# EAGLE design XO-Stick2 (EAGLE 6.2)
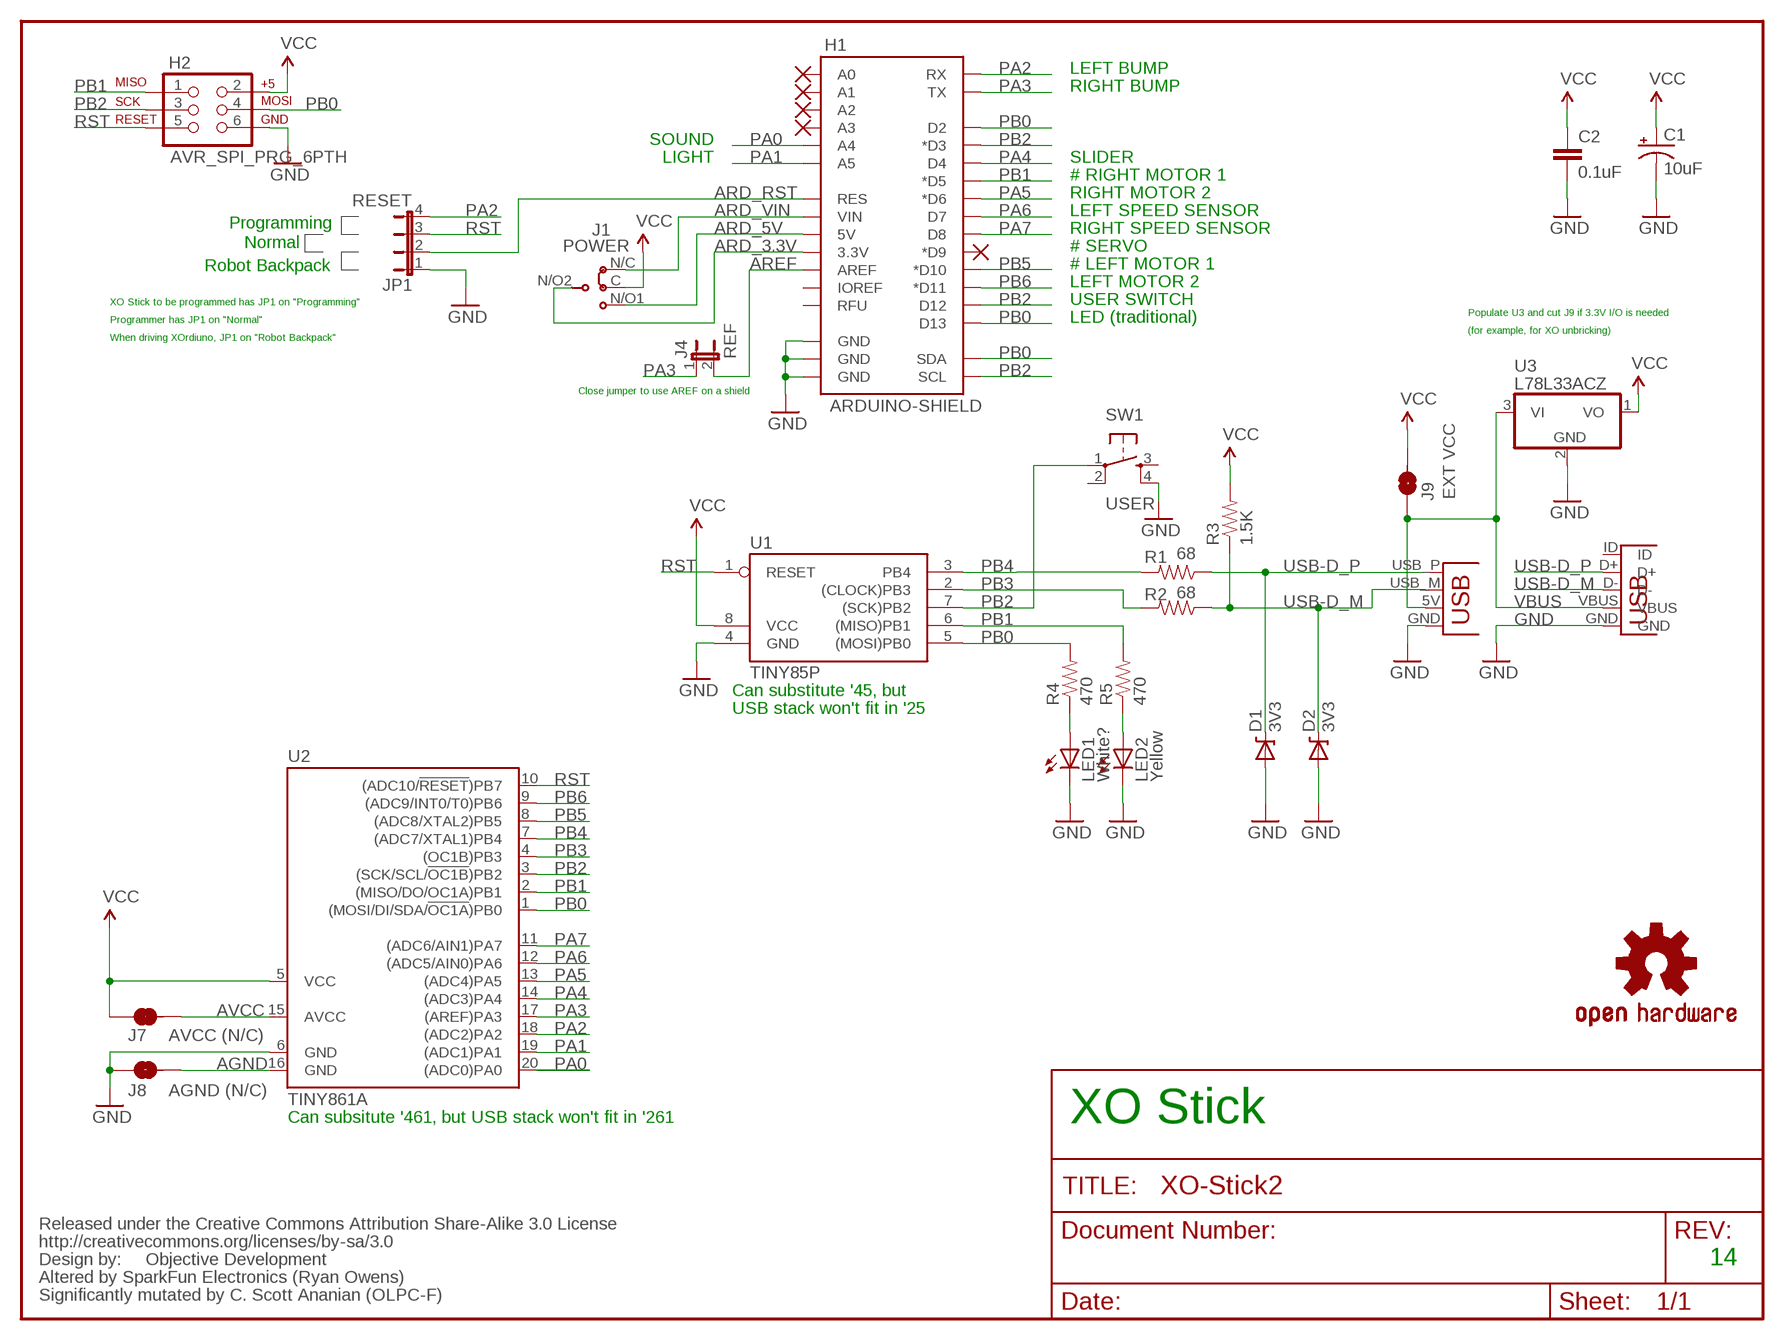
[diagram p0: schematic, sheet 1]

## Parts
C1  10uF  CAP_POLPTH2  [CPOL-RADIAL-10UF-25V]
C2  0.1uF  CAPKIT  [CAP-PTH-SMALL-KIT]
D1  3V3  DIODE-ZENERPTH  [DIODE-ZENER]
D2  3V3  DIODE-ZENERPTH  [DIODE-ZENER]
H1  ARDUINO-SHIELD  [ARDUINO-SHIELD-VIAS-HOLES]
H2  AVR_SPI_PRG_6PTH  [2X3]
J1  POWER  JUMPER-4WAY  [JP4-TRACE-NOCONFLICT]
J4  REF  JUMPER-2SJ-NO  [SJ-2S-NO]
J7  AVCC (N/C)  SOLDERJUMPERBOT-NOCONFLICT  [SJ-2S-BOT-TRACE-NOCONFLICT]
J8  AGND (N/C)  SOLDERJUMPERBOT-NOCONFLICT  [SJ-2S-BOT-TRACE-NOCONFLICT]
J9  EXT VCC  SOLDERJUMPERBOT-NOCONFLICT-PAD  [SJ-2S-BOT-TRACE-NOCONFLICT-PAD]
JP1  RESET  JUMPER-4  [JP4]
LED1  White?  LED3MM-KIT  [LED3MM-KIT]
LED2  Yellow  LED3MM-KIT  [LED3MM-KIT]
R1  68  RESISTORKIT  [AXIAL-0.3-KIT]
R2  68  RESISTORKIT  [AXIAL-0.3-KIT]
R3  1.5K  RESISTORKIT  [AXIAL-0.3-KIT]
R4  470  RESISTORKIT  [AXIAL-0.3-KIT]
R5  470  RESISTORKIT  [AXIAL-0.3-KIT]
SW1  USER  TAC_SWITCHPTH  [TACTILE-PTH]
U1  TINY85P  [DIL08]
U2  TINY861A  TINY26LP  [DIL20]
U3  L78L33ACZ  78L05Z  [TO92]
U$1  OSHW-LOGOM  [OSHW-LOGO-M]
U$4  CREATIVE_COMMONS  [CREATIVE_COMMONS]
X1  USBPCB  [USB-A-PCB]
X2  USBMINIB  [USB-MB-H2]

## Nets
AGND: J8.2 U2.16(GND)
ARD_3.3V [vcc]: H1.3.3V J1.N/O2
ARD_5V [vcc]: H1.5V J1.N/O1
ARD_RST: H1.RES JP1.2
ARD_VIN [vcc]: H1.VIN J1.N/C
AREF: H1.AREF J4.2
AVCC: J7.2 U2.15(AVCC)
GND [gnd]: C1.2(-) C2.2 D1.P$2(A) D2.P$2(A) H1.GND@0(GND) H1.GND@1(GND) H1.GND@2(GND) H2.6 J8.1 JP1.1 LED1.K(C) LED2.K(C) SW1.4 U1.4(GND) U2.6(GND) U3.2(GND) X1.GND X2.GND
N$7: LED1.A R4.P$1
N$9: LED2.A R5.P$1
PA0: H1.A4 U2.20((ADC0)PA0)
PA1: H1.A5 U2.19((ADC1)PA1)
PA2: H1.RX JP1.4 U2.18((ADC2)PA2)
PA3: H1.TX J4.1 U2.17((AREF)PA3)
PA4: H1.D4 U2.14((ADC3)PA4)
PA5: H1.D6(*D6) U2.13((ADC4)PA5)
PA6: H1.D7 U2.12((ADC5/AIN0)PA6)
PA7: H1.D8 U2.11((ADC6/AIN1)PA7)
PB0: H1.D2 H1.D13 H1.SDA H2.4 R4.P$2 U1.5((MOSI)PB0) U2.1((MOSI/DI/SDA/!OC1A!)PB0)
PB1: H1.D5(*D5) H2.1 R5.P$2 U1.6((MISO)PB1) U2.2((MISO/DO/OC1A)PB1)
PB2: H1.D3(*D3) H1.D12 H1.SCL H2.3 SW1.1 U1.7((SCK)PB2) U2.3((SCK/SCL/!OC1B!)PB2)
PB3: R2.P$2 U1.2((CLOCK)PB3) U2.4((OC1B)PB3)
PB4: R1.P$2 U1.3(PB4) U2.7((ADC7/XTAL1)PB4)
PB5: H1.D10(*D10) U2.8((ADC8/XTAL2)PB5)
PB6: H1.D11(*D11) U2.9((ADC9/INT0/T0)PB6)
RST: H2.5 JP1.3 U1.1(RESET) U2.10((ADC10/!RESET!)PB7)
USB-D_M: D2.P$1(C) R2.P$1 R3.P$1 X1.USB_M(D-) X2.D-
USB-D_P: D1.P$1(C) R1.P$1 X1.USB_P(D+) X2.D+
VBUS [vcc]: J9.1 U3.3(VI) X1.5V(VBUS) X2.VBUS
VCC [vcc]: C1.1(+) C2.1 H2.2 J1.C J7.1 J9.2 R3.P$2 U1.8(VCC) U2.5(VCC) U3.1(VO)
Unconnected: H1.A0 H1.A1 H1.A2 H1.A3 H1.D9(*D9) H1.IOREF H1.RFU SW1.2 SW1.3 X2.ID

## Notes on the sheet
- LEFT BUMP
- RIGHT BUMP
- SOUND
- LIGHT | SLIDER
- # RIGHT MOTOR 1
- RIGHT MOTOR 2
- LEFT SPEED SENSOR
- Programming
- RIGHT SPEED SENSOR
- Normal | # SERVO
- Robot Backpack | # LEFT MOTOR 1
- LEFT MOTOR 2
- XO Stick to be programmed has JP1 on "Programming" | USER SWITCH
- Populate U3 and cut J9 if 3.3V I/O is needed
- Programmer has JP1 on "Normal" | LED (traditional)
- (for example, for XO unbricking)
- When driving XOrdiuno, JP1 on "Robot Backpack"
- Close jumper to use AREF on a shield
- Can substitute '45, but
- USB stack won't fit in '25
- Can subsitute '461, but USB stack won't fit in '261 | XO Stick
- Objective Development | 14
- Altered by SparkFun Electronics (Ryan Owens)
- Significantly mutated by C. Scott Ananian (OLPC-F)

## Library data of the parts
C1 = SparkFun:CAP_POL: Capacitor Polarized These are standard SMD and PTH capacitors. Normally 10uF, 47uF, and 100uF in electrolytic and tantalum varieties. Always verify the external diameter of the through hole cap, it varies with capacity, voltage, and manufacturer. The EIA devices should be standard.
C2 = SparkFun-Passives:CAP: Capacitor Standard 0603 ceramic capacitor, and 0.1" leaded capacitor.
D1 D2 = SparkFun:DIODE-ZENER: Zener Diode Production Part - 8199 3.4V Zener Voltage
H1 = xorduino:ARDUINO-SHIELD: Arduino 1.0 Shield Footprint.
H2 = SparkFun:AVR_SPI_PRG_6: AVR ISP 6 Pin This is the reduced ISP connector for AVR programming. Common on Arduino. This footprint will take up less PCB space and can be used with a 10-pin to 6-pin adapter such as SKU: BOB-08508
J1 = xorduino:JUMPER-4WAY
J4 = xorduino:JUMPER-2: 2-pin jumper, normally open or normally closed.
J7-J9 = xorduino:SOLDERJUMPER
JP1 = xorduino:JUMPER-4
LED1 LED2 = xorduino:LED
R1-R5 = SparkFun-Passives:RESISTOR: Resistor Basic schematic elements and footprints for 0603, 1206, and PTH resistors.
SW1 = SparkFun:TAC_SWITCH: Momentary Switch Button commonly used for reset or general input. Spark Fun Electronics SKU : COM-00097
U1 = atmel:TINY85: MICROCONTROLLER 1K ROM 128 bytes RAM 128 bytes EEPROM
U2 = atmel:TINY26*: 8-bit AVR Microcontroller with 2K Bytes Flash Source: http://www.atmel.com .. doc1477.pdf; MPN: ATTINY26L-8PU; OC_FARNELL: 9171657; OC_NEWARK: 01M6920
U3 = linear:78*: Positive VOLTAGE REGULATOR Source: http://cache.national.com/ds/LM/LM78L05.pdf http://www.fairchildsemi.com/ds/LM/LM7805.pdf
U$1 = SparkFun:OSHW-LOGO: Open Source Hardware Logo This logo indicates the piece of hardware it is found on incorporates a OSHW license and/or adheres to the definition of open source hardware found here: http://freedomdefined.org/OSHW
U$4 = SparkFun:CREATIVE_COMMONS
X1 = SparkFun:USB: USB Connectors USB-B-PTH is fully proven SKU : PRT-00139 USB-miniB is fully proven SKU : PRT-00587 USB-A-PCB is untested. USB-A-H is throughly reviewed, but untested. Spark Fun Electronics SKU : PRT-00437 USB-B-SMT is throughly reviewed, but untested. Needs silkscreen touching up. USB-A-S has not been used/tested USB-MB-H has not been used/tested
X2 = xorduino:USB

## Net classes
0 default: width 0.254 mm, drill 0.406 mm, clearance 0.254 mm
1 vcc: width 0.508 mm, drill 0.406 mm, clearance 0.254 mm
2 gnd: width 0.508 mm, drill 0.406 mm, clearance 0.254 mm

## Board
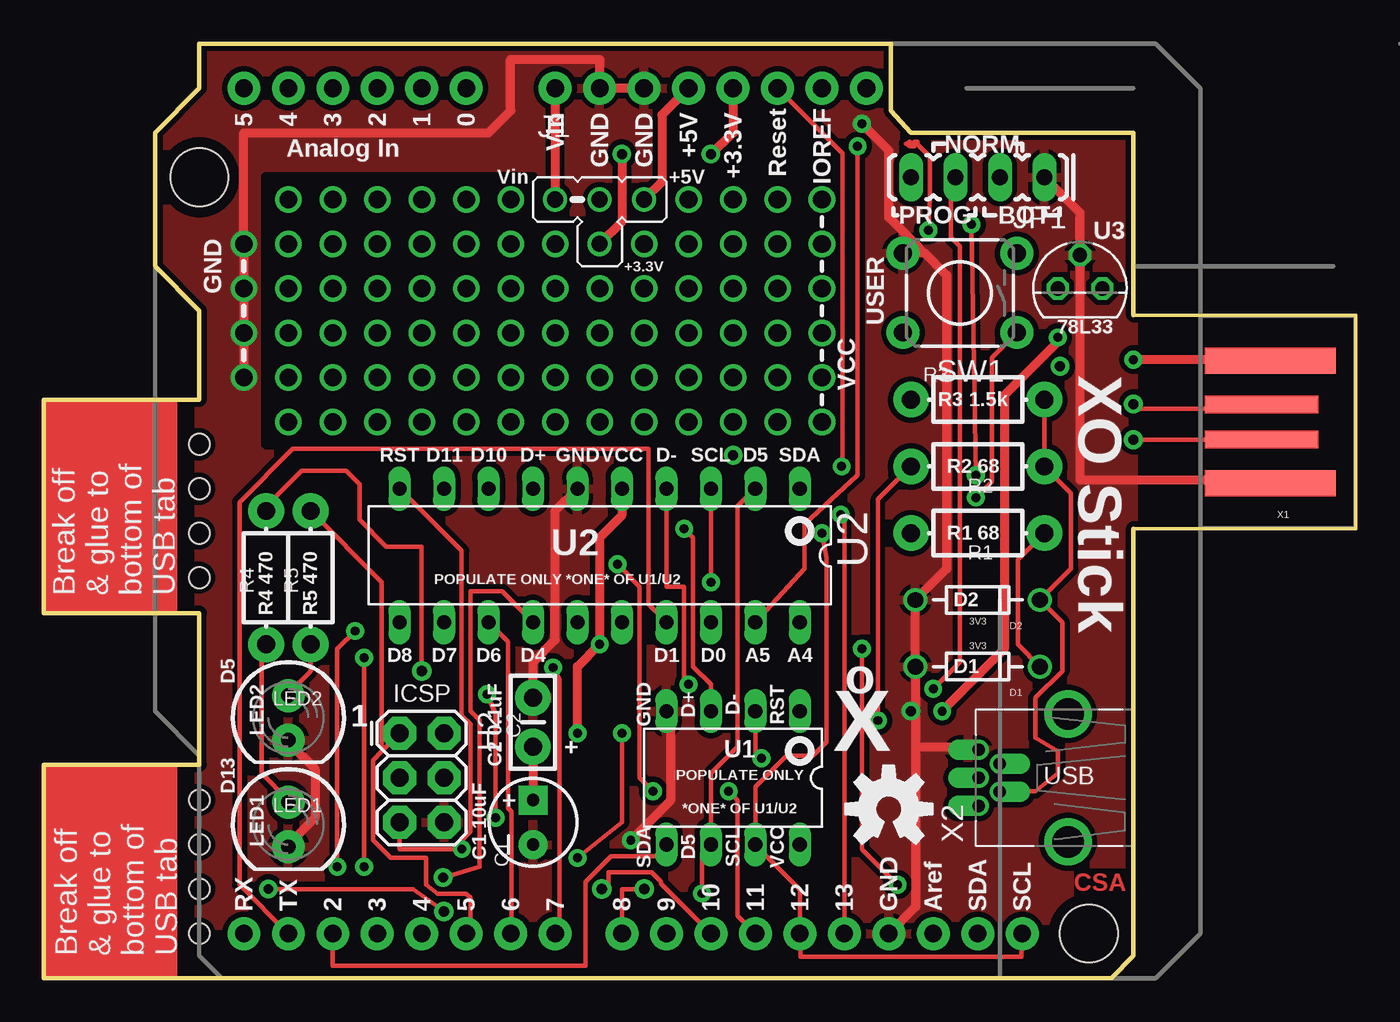
[diagram p1: board, top side]
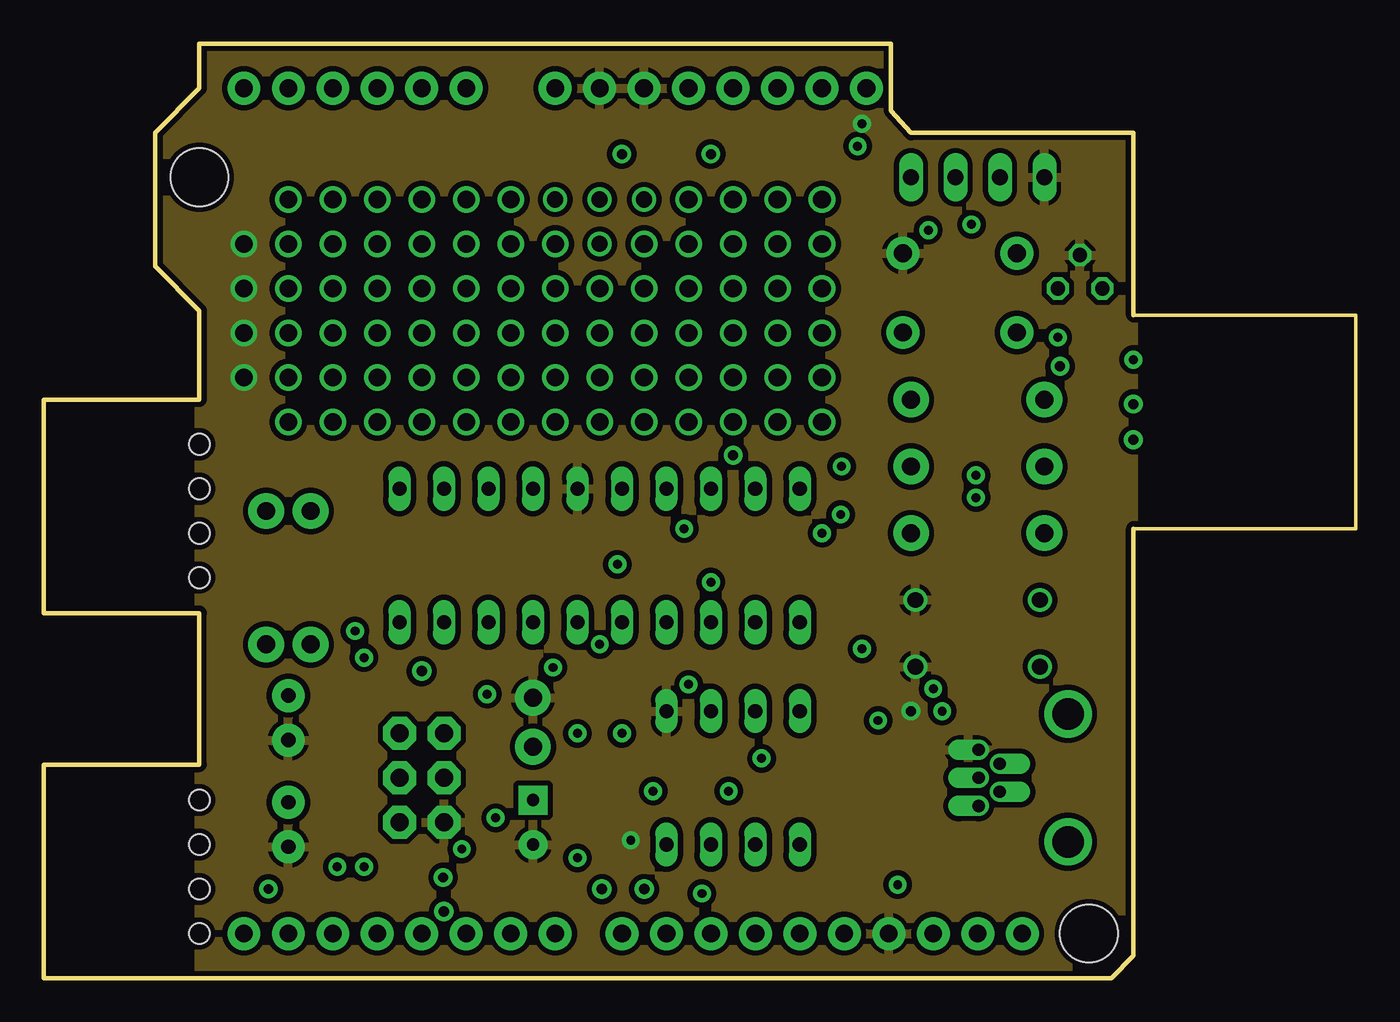
[diagram p2: board, inner layer Route2]
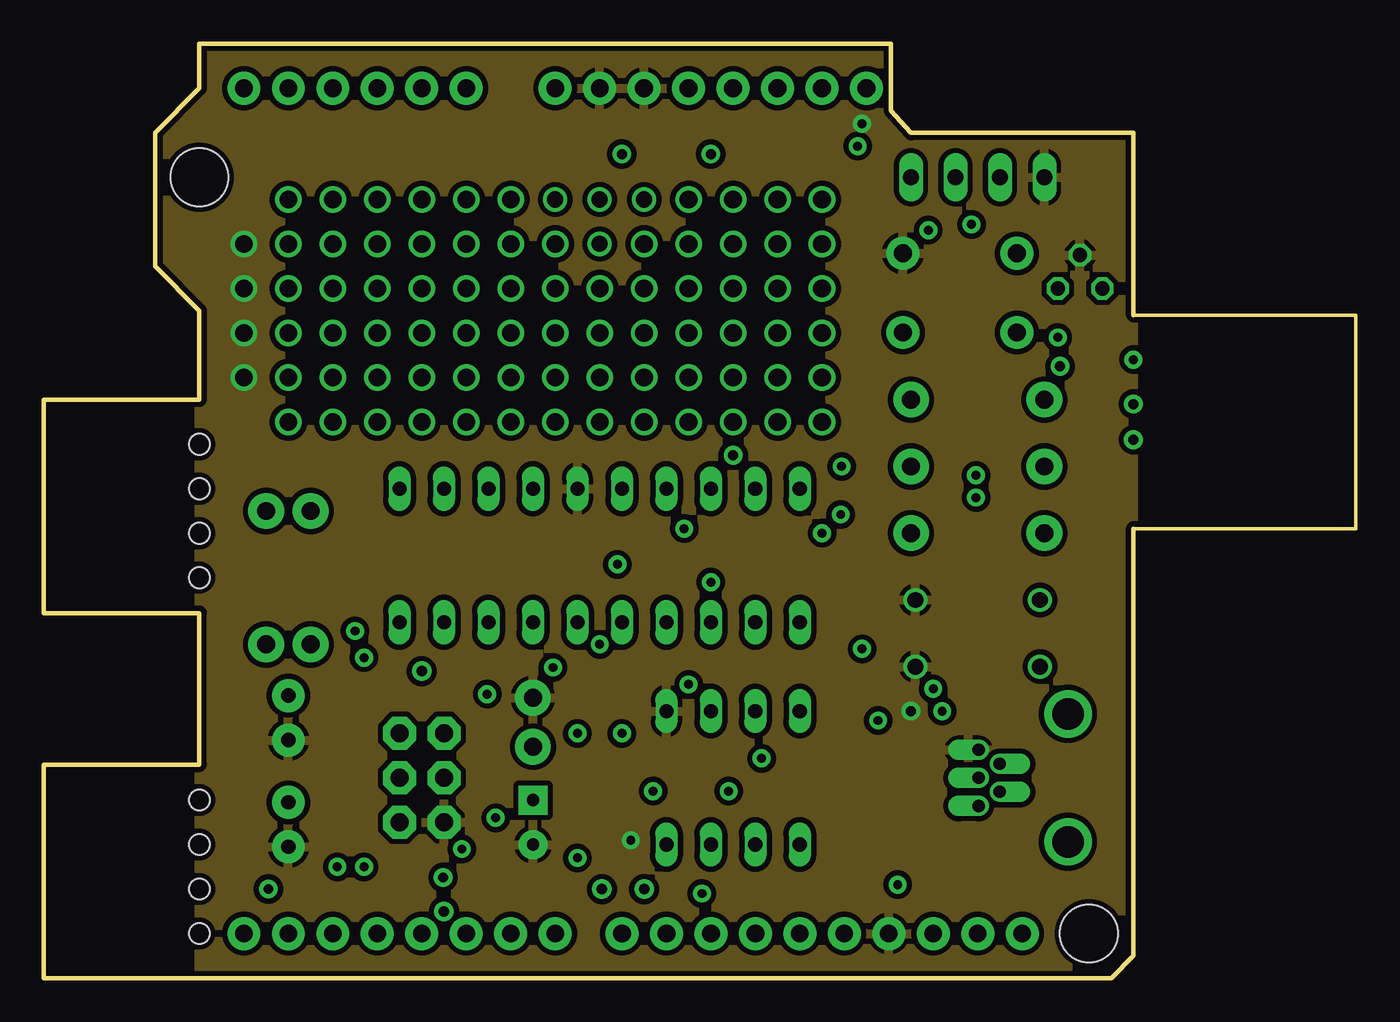
[diagram p3: board, inner layer Route15]
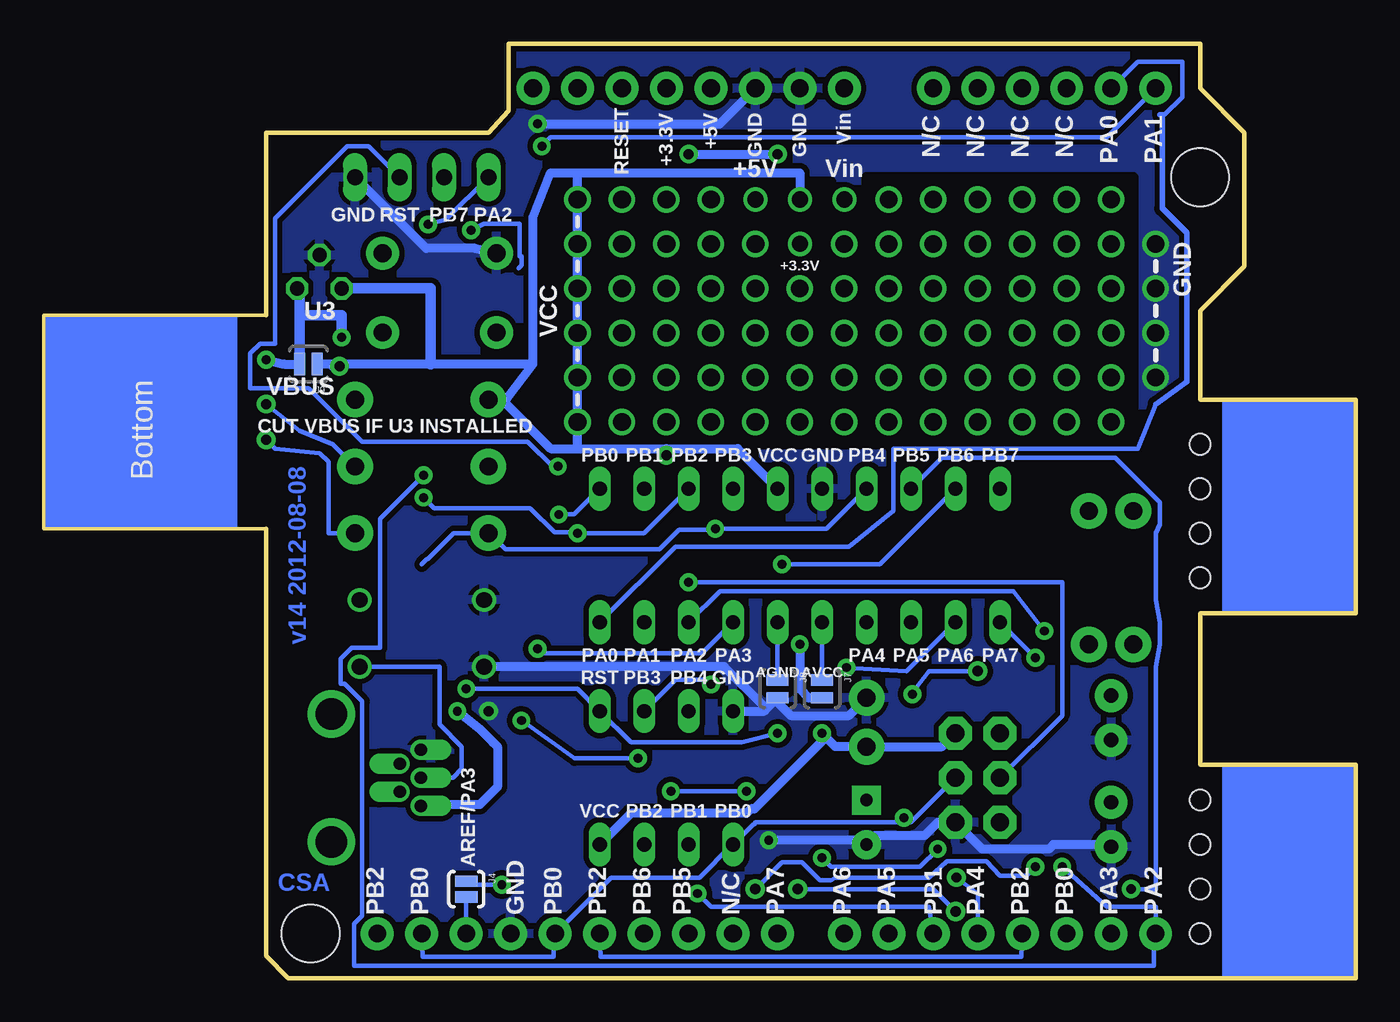
[diagram p4: board, bottom side, seen from below]

Size 74.93 x 53.34 mm. Coordinates in mm from the lower left corner, seen from the top.
Outline: 62.23,25.65 74.93,25.65 74.93,37.85 62.23,37.85 62.23,48.26 49.53,48.26 48.39,49.53 48.39,53.34 8.89,53.34 8.89,50.8 6.35,48.26 6.35,40.64 8.89,38.1 8.89,33.02 0,33.02 0,20.83 8.89,20.83 8.89,12.19 0,12.19 0,0 60.96,0 62.23,1.27 62.23,25.65
Copper layers (1+16): Top 0.035mm / dielectric 0.2mm / Bottom 0.035mm
Design rules: minimum track width 8mil, minimum drill 20mil, track to track 8mil, track to pad 8mil, pad to pad 8mil, via to via 8mil, smd to smd 8mil, copper to edge 10mil, drill to drill 8mil, minimum pad ring 9mil, minimum via ring 10mil, stop-mask expansion 4mil, vias tented up to drill 25mil, thermal gap 10mil
Holes 1.2 mm at 8.89,30.48 8.89,27.94 8.89,22.86 8.89,10.16 8.89,7.62 8.89,5.08 8.89,2.54 8.89,25.4
tRestrict: area 12.7,30.5 to 27.9,45.7; area 35.6,30.5 to 43.2,45.7; area 27.9,30.5 to 35.6,43.2
bRestrict: area 12.7,30.5 to 27.9,45.7; area 35.6,30.5 to 43.2,45.7; area 27.9,30.5 to 35.6,43.2
vRestrict: area 12.1,20.4 to 13.3,25.4; area 14.6,20.6 to 15.9,25.4; area 58.9,30.2 to 61.7,34.4; area 58.9,18.2 to 61.7,27.4

### Footprints (pad centres in the part's own frame; a part is rotated, then mirrored left to right if it is on the bottom)
CPOL-RADIAL-10UF-25V = drill 0.7 pad 1.651 square: 1 1.27,0 | drill 0.7 pad 1.651: 2 -1.27,0
CAP-PTH-SMALL-KIT = drill 1.016 pad 2.032: 1 -1.397,0; 2 1.397,0
DIODE-ZENER = drill 0.9: P$1 -3.556,0; P$2 3.556,0
ARDUINO-SHIELD-VIAS-HOLES = drill 1.016 pad 1.88: 3.3V 30.48,50.8; 5V 27.94,50.8; A0 15.24,50.8; A1 12.7,50.8; A2 10.16,50.8; A3 7.62,50.8; A4 5.08,50.8; A5 2.54,50.8; AREF 41.91,2.54; D2 7.62,2.54; D3 10.16,2.54; D4 12.7,2.54; D5 15.24,2.54; D6 17.78,2.54; D7 20.32,2.54; D8 24.13,2.54; D9 26.67,2.54; D10 29.21,2.54; D11 31.75,2.54; D12 34.29,2.54; D13 36.83,2.54; GND@0 25.4,50.8; GND@1 22.86,50.8; GND@2 39.37,2.54; IOREF 35.56,50.8; RES 33.02,50.8; RFU 38.1,50.8; RX 2.54,2.54; SCL 46.99,2.54; SDA 44.45,2.54; TX 5.08,2.54; VIN 20.32,50.8 | hole 3.302: 0,45.72; 50.8,2.54
2X3 = drill 1.016 pad 1.88 octagon: 1 0,0; 2 0,2.54; 3 2.54,0; 4 2.54,2.54; 5 5.08,0; 6 5.08,2.54
JP4-TRACE-NOCONFLICT = drill 0.914: C 0,0; N/C -2.54,0; N/O1 2.54,0; N/O2 0,-2.54
SJ-2S-NO = smd 0.635 x 1.27: 1 -0.45,0; 2 0.45,0
SJ-2S-BOT-TRACE-NOCONFLICT = smd 0.635 x 1.27 bottom: 1 -0.508,0; 2 0.508,0
SJ-2S-BOT-TRACE-NOCONFLICT-PAD = smd 0.635 x 1.27 bottom: 1 -0.508,0; 2 0.508,0
JP4 = drill 0.914 long: 1 -3.81,0; 2 -1.27,0; 3 1.27,0; 4 3.81,0
LED3MM-KIT = drill 0.813 pad 1.88: A -1.27,0; K 1.27,0
AXIAL-0.3-KIT = drill 1.016 pad 2.032: P$1 -3.81,0; P$2 3.81,0
TACTILE-PTH = drill 1.016 pad 1.88: 1 -3.251,2.261; 2 3.251,2.261; 3 -3.251,-2.261; 4 3.251,-2.261
DIL08 = drill 0.813 long: 1 -3.81,-3.81; 2 -1.27,-3.81; 3 1.27,-3.81; 4 3.81,-3.81; 5 3.81,3.81; 6 1.27,3.81; 7 -1.27,3.81; 8 -3.81,3.81
DIL20 = drill 0.813 long: 1 -11.43,-3.81; 2 -8.89,-3.81; 3 -6.35,-3.81; 4 -3.81,-3.81; 5 -1.27,-3.81; 6 1.27,-3.81; 7 3.81,-3.81; 8 6.35,-3.81; 9 8.89,-3.81; 10 11.43,-3.81; 11 11.43,3.81; 12 8.89,3.81; 13 6.35,3.81; 14 3.81,3.81; 15 1.27,3.81; 16 -1.27,3.81; 17 -3.81,3.81; 18 -6.35,3.81; 19 -8.89,3.81; 20 -11.43,3.81
TO92 = drill 0.813 octagon: 1 -1.27,0; 2 0,1.905; 3 1.27,0
USB-A-PCB = smd 7.5 x 1.5: 5V -0.2,-3.5; GND -0.2,3.5 | smd 6.5 x 1: USB_M 0.3,-1; USB_P 0.3,1
USB-MB-H2 = drill 0.7 pad 1.1 offset: D+ 5.1,0; D- 3.9,0.8; GND 5.1,-1.6; ID 3.9,-0.8; VBUS 5.1,1.6 | drill 1.8 pad 2.7: P$6 0,-3.65; P$7 0,3.65

### Placement (x,y rotation side)
C1  27.94,8.89 90 top
C2  27.94,14.61 90 top
D1  53.34,17.78 180 top
D2  53.34,21.59 180 top
H1  8.89,0 0 top
H2  20.32,13.97 270 top
J1  31.75,44.45 0 top
J4  50.8,5.08 270 bottom
J7  30.48,16.51 90 top
J8  33.02,16.51 90 top
J9  59.82,35.05 180 top
JP1  53.34,45.72 180 top
LED1  13.97,8.76 270 top
LED2  13.97,14.86 270 top
R1  53.34,25.4 180 top
R2  53.34,29.21 180 top
R3  53.34,33.02 180 top
R4  12.7,22.86 90 top
R5  15.24,22.86 90 top
SW1  52.32,39.12 180 top
U1  39.37,11.43 180 top
U2  31.75,24.13 180 top
U3  59.18,39.37 0 top
U$1  48.26,9.65 0 top
U$4  20.32,-10.16 0 top  (outside the outline)
X1  69.85,31.75 180 top
X2  58.5,11.43 180 top

### Tracks (layer width: path | path; a pad name or v marks a point on that pad's centre or on a via)
AGND
  Bottom 0.254: U2.16 J8.2
ARD_3.3V  (via drill 0.56 pad 1.07)
  Top 0.508: H1.3.3V 39.37,48.26 v38.1,47.04 | v33.02,47.04 33.02,43.18 J1.N/O2
  Bottom 0.508: v38.1,47.04 v33.02,47.04
ARD_5V
  Top 0.508: J1.N/O1 35.31,45.47 35.31,49.28 H1.5V
ARD_RST  (via drill 0.51)
  Top 0.254: v45.57,29.21 45.62,29.26 45.62,47.09 H1.RES
  Bottom 0.254: JP1.2 56.39,47.5 57.61,47.5 61.72,43.38 61.72,36.22 62.59,36.22 63.14,35.66 63.14,33.68 59.79,33.68 56.74,30.63 47.3,30.63 45.87,29.21 v45.57,29.21
ARD_VIN
  Top 0.508: H1.VIN J1.N/C
AREF
  Bottom 0.254: H1.AREF 50.8,4.57 J4.2
AVCC
  Bottom 0.254: U2.15 J7.2
GND  (via drill 0.51, 0.56 pad 1.07, 1.02)
  Top 0.508: 49.78,13.21 53.34,13.21 X2.GND | 49.78,15.24 D1.P$2 D2.P$2 51.56,23.37 51.56,40.13 50.29,41.4 SW1.4 50.04,41.66 48.26,43.43 48.26,47.24 v46.74,48.77 | 49.78,15.24 49.78,13.21 | H1.GND@2 49.78,4.06 49.78,13.21 | H1.GND@0 H1.GND@1 31.75,52.45 26.67,52.45 26.67,49.53 25.4,48.26 11.43,48.26 v11.43,41.91 v11.43,39.37 v11.43,36.83 v11.43,34.29 | 59.18,43.43 59.18,43.69 JP1.1 | 59.18,43.43 U3.2 | U3.2 59.18,28.45 69.85,28.45 X1.GND | U2.6 29.21,26.67 29.21,19.3 27.94,18.03 C2.2 | LED1.K 13.97,7.62 15.49,9.14 15.49,11.94 13.97,13.46 LED2.K | U1.4 35.81,14.99 35.81,10.16 v33.53,7.87 | v49.53,15.24 49.78,15.24 | U3.2 59.18,43.43
  Bottom 0.508: 33.66,15.37 33.78,15.24 U1.4 | 33.66,15.37 J8.1 33.02,15.75 32.26,14.99 28.96,14.99 C2.2 | D1.P$2 36.07,17.78 33.78,15.49 33.66,15.37 | JP1.1 53.09,41.66 50.29,41.66 SW1.4 | H1.GND@0 36.32,48.77 v46.74,48.77 | LED1.K 13.97,7.62 17.27,7.62 17.53,7.37 21.34,7.37 H2.6 23.88,8.89 24.64,8.13 27.43,8.13 C1.2 27.94,7.87 v33.53,7.87
  pour Bottom (isolate 0.305): 8.89,0 8.89,38.1 6.35,40.64 6.35,48.26 8.89,50.8 8.89,53.34 48.26,53.34 48.26,49.53 49.53,48.26 62.23,48.26 62.23,0
  pour Top (isolate 0.305): 8.89,0 8.89,38.1 6.35,40.64 6.35,48.26 8.89,50.8 8.89,53.34 48.26,53.34 48.26,49.53 49.53,48.26 62.23,48.26 62.23,0
  pour Route15 (isolate 0.305): 8.89,0 8.89,38.1 6.35,40.64 6.35,48.26 8.89,50.8 8.89,53.34 48.26,53.34 48.26,49.53 49.53,48.26 62.23,48.26 62.23,0
  pour Route2 (isolate 0.305): 8.89,0 8.89,38.1 6.35,40.64 6.35,48.26 8.89,50.8 8.89,53.34 48.26,53.34 48.26,49.53 49.53,48.26 62.23,48.26 62.23,0
N$1  (via drill 1.02)
  other vias: 41.91,41.91
N$2  (via drill 1.02)
  other vias: 13.97,41.91
N$7
  Top 0.254: R4.P$1 12.45,18.8 12.45,11.68 13.97,10.16 LED1.A
N$9
  Top 0.254: R5.P$1 15.24,17.53 13.97,16.26 LED2.A
N$42  (via drill 1.02)
  other vias: 41.91,31.75
N$43  (via drill 1.02)
  other vias: 41.91,34.29
N$44  (via drill 1.02)
  other vias: 41.91,36.83
N$45  (via drill 1.02)
  other vias: 41.91,39.37
N$47  (via drill 1.02)
  other vias: 41.91,44.45
N$53  (via drill 1.02)
  other vias: 39.37,31.75
N$54  (via drill 1.02)
  other vias: 39.37,34.29
N$55  (via drill 1.02)
  other vias: 39.37,36.83
N$56  (via drill 1.02)
  other vias: 39.37,39.37
N$57  (via drill 1.02)
  other vias: 39.37,41.91
N$58  (via drill 1.02)
  other vias: 39.37,44.45
N$64  (via drill 1.02)
  other vias: 36.83,31.75
N$65  (via drill 1.02)
  other vias: 36.83,34.29
N$66  (via drill 1.02)
  other vias: 36.83,36.83
N$67  (via drill 1.02)
  other vias: 36.83,39.37
N$68  (via drill 1.02)
  other vias: 36.83,41.91
N$69  (via drill 1.02)
  other vias: 36.83,44.45
N$75  (via drill 1.02)
  other vias: 34.29,31.75
N$76  (via drill 1.02)
  other vias: 34.29,34.29
N$77  (via drill 1.02)
  other vias: 34.29,36.83
N$78  (via drill 1.02)
  other vias: 34.29,39.37
N$79  (via drill 1.02)
  other vias: 34.29,41.91
N$86  (via drill 1.02)
  other vias: 31.75,31.75
N$87  (via drill 1.02)
  other vias: 31.75,34.29
N$88  (via drill 1.02)
  other vias: 31.75,36.83
N$89  (via drill 1.02)
  other vias: 31.75,39.37
N$97  (via drill 1.02)
  other vias: 29.21,31.75
N$98  (via drill 1.02)
  other vias: 29.21,34.29
N$99  (via drill 1.02)
  other vias: 29.21,36.83
N$100  (via drill 1.02)
  other vias: 29.21,39.37
N$101  (via drill 1.02)
  other vias: 29.21,41.91
N$108  (via drill 1.02)
  other vias: 26.67,31.75
N$109  (via drill 1.02)
  other vias: 26.67,34.29
N$110  (via drill 1.02)
  other vias: 26.67,36.83
N$111  (via drill 1.02)
  other vias: 26.67,39.37
N$112  (via drill 1.02)
  other vias: 26.67,41.91
N$113  (via drill 1.02)
  other vias: 26.67,44.45
N$119  (via drill 1.02)
  other vias: 24.13,31.75
N$120  (via drill 1.02)
  other vias: 24.13,34.29
N$121  (via drill 1.02)
  other vias: 24.13,36.83
N$122  (via drill 1.02)
  other vias: 24.13,39.37
N$123  (via drill 1.02)
  other vias: 24.13,41.91
N$124  (via drill 1.02)
  other vias: 24.13,44.45
N$130  (via drill 1.02)
  other vias: 21.59,31.75
N$131  (via drill 1.02)
  other vias: 21.59,34.29
N$132  (via drill 1.02)
  other vias: 21.59,36.83
N$133  (via drill 1.02)
  other vias: 21.59,39.37
N$134  (via drill 1.02)
  other vias: 21.59,41.91
N$135  (via drill 1.02)
  other vias: 21.59,44.45
N$141  (via drill 1.02)
  other vias: 19.05,31.75
N$142  (via drill 1.02)
  other vias: 19.05,34.29
N$143  (via drill 1.02)
  other vias: 19.05,36.83
N$144  (via drill 1.02)
  other vias: 19.05,39.37
N$145  (via drill 1.02)
  other vias: 19.05,41.91
N$146  (via drill 1.02)
  other vias: 19.05,44.45
N$152  (via drill 1.02)
  other vias: 16.51,31.75
N$153  (via drill 1.02)
  other vias: 16.51,34.29
N$154  (via drill 1.02)
  other vias: 16.51,36.83
N$155  (via drill 1.02)
  other vias: 16.51,39.37
N$156  (via drill 1.02)
  other vias: 16.51,41.91
N$157  (via drill 1.02)
  other vias: 16.51,44.45
N$163  (via drill 1.02)
  other vias: 13.97,31.75
N$164  (via drill 1.02)
  other vias: 13.97,34.29
N$165  (via drill 1.02)
  other vias: 13.97,36.83
N$166  (via drill 1.02)
  other vias: 13.97,39.37
N$168  (via drill 1.02)
  other vias: 13.97,44.45
PA0
  Bottom 0.254: U2.20 38.86,24.64 28.96,24.64 26.42,26.67 26.42,30.23 12.45,30.23 11.43,32.77 | 11.18,49.28 10.92,49.28 9.91,50.29 9.91,52.32 12.45,52.32 H1.A4
  Bottom 0.305: 11.18,49.28 11.05,49.28 11.05,43.94 9.65,42.55 9.65,34.04 11.43,32.77
PA1  (via drill 0.51)
  Top 0.254: U2.19 43.43,23.37 43.43,25.91 46.48,28.7 v46.48,47.5
  Bottom 0.254: v46.48,47.5 45.97,48.01 14.22,48.01 H1.A5
PA2  (via drill 0.51)
  Top 0.254: v53.24,28.7 v52.98,43.03 | v17.78,19.81 16.76,18.8 v16.76,6.35
  Bottom 0.254: U2.18 36.32,22.1 19.56,22.1 v17.78,19.81 | v16.76,6.35 14.22,4.06 11.43,4.06 H1.RX 11.53,2.49 11.53,0.71 57.2,0.71 57.2,3.1 56.74,3.56 56.74,15.8 57.76,16.82 57.96,16.82 57.96,18.24 57.35,18.85 55.73,18.85 55.73,26.21 v53.24,28.7 | JP1.4 51.97,43.28 v52.98,43.03
PA3  (via drill 0.51)
  Top 0.254: v48.77,5.33 46.74,7.37 v46.74,18.8 | H1.TX 11.18,5.33 11.18,27.18 14.22,30.23 34.54,30.23 34.54,21.34 U2.17
  Bottom 0.254: v48.77,5.33 50.8,5.33 J4.1 | v46.74,18.8 46.48,18.54 37.34,18.54 U2.17
PA4  (via drill 0.56 pad 1.07)
  Top 0.254: U2.14 26.16,22.1 24.38,22.1 24.38,15.24 24.89,14.73 24.89,6.35 | 24.89,6.35 v22.81,5.74 24.89,6.35
  Bottom 0.254: H1.D4 21.59,4.83 v22.81,5.74
PA5
  Top 0.254: U2.13 26.52,19.2 26.52,9.7 26.72,9.5 26.72,2.59 H1.D6
PA6  (via drill 0.51)
  Top 0.254: v29.08,17.73 29.46,17.02 29.46,2.79 H1.D7
  Bottom 0.254: U2.12 25.65,17.53 v29.08,17.73
PA7  (via drill 0.51, 0.6)
  Top 0.254: v18.29,6.35 v18.29,18.29 | v34.29,5.08 33.02,5.08 H1.D8
  Bottom 0.254: v18.29,18.29 U2.11 | v18.29,6.35 18.8,5.84 20.32,5.84 21.08,6.66 23.34,6.66 24.38,5.71 29.72,5.71 29.97,5.59 30.61,5.59 31.62,6.6 32.77,6.6 v34.29,5.08
PB0  (via drill 0.51, 0.6)
  Top 0.254: v45.52,26.47 45.72,26.26 H1.D13 | H1.D2 16.51,0.71 30.94,0.71 30.94,5.49 32.41,6.96 35.56,6.96 U1.5 | v21.59,17.53 21.59,24.64 19.56,24.64 18.03,26.16 18.03,28.19 17.27,28.96 14.73,28.96 12.7,26.92 R4.P$2 | v25.32,16.2 25.81,15.09 v25.81,9.14
  Bottom 0.254: H2.4 25.4,8.89 25.65,8.89 25.81,8.89 | 25.81,8.89 34.29,8.89 34.34,8.79 34.39,8.79 U1.5 35.66,7.57 37.49,5.74 42.52,5.74 H1.D13 45.82,2.49 45.82,1.22 53.29,1.22 H1.SDA | U2.1 44.65,26.47 v45.52,26.47 | v21.59,17.53 24.38,17.53 25.15,16.51 25.32,16.41 v25.32,16.2 | v25.81,9.14 25.81,8.99 25.81,8.89
PB1  (via drill 0.51)
  Top 0.254: U2.2 39.62,26.92 39.62,13.21 38.1,11.68 U1.6 37.59,7.11 v37.59,4.83 | H2.1 19.38,13.03 | 19.38,13.03 19.3,12.95 18.8,12.45 18.8,7.87 19.81,6.86 21.84,6.86 21.84,5.33 22.48,4.83 24.13,4.83 24.38,4.57 24.38,2.79 H1.D5 | R5.P$2 19.3,22.61 19.3,13.11 19.38,13.03
  Bottom 0.254: v37.59,4.83 36.83,4.06 24.38,4.06 H1.D5
PB2  (via drill 0.51)
  Top 0.254: v44.45,25.4 44.7,24 44.7,14.73 44.7,13.46 43.94,12.7 42.42,12.7 40.64,10.92 40.64,10.82 U1.7 40.69,7.52 43.18,5.03 H1.D12 43.23,2.44 43.23,1.22 55.83,1.22 H1.SCL | U2.3 v38.1,22.61 | v53.24,27.43 54.15,28.35 54.15,35.41 55.58,36.83 SW1.1
  Bottom 0.254: U2.3 40.64,25.4 v44.45,25.4 44.81,25.45 45.77,25.45 47.14,26.82 52.63,26.82 v53.24,27.43 | H2.3 16.76,14.99 16.76,22.61 v38.1,22.61 | H1.D3 19.1,1.22 43.13,1.22 H1.D12
PB3  (via drill 0.51)
  Top 0.254: U2.4 35.56,22.35 36.58,22.35 36.58,16.76 v36.83,16.76 | R2.P$2 47.65,27.33 v47.65,14.71 | v41,12.55 40.64,12.9 U1.2
  Bottom 0.254: U1.2 38.86,17.02 37.08,17.02 v36.83,16.76 | v47.65,14.71 44.6,12.55 v41,12.55
PB4  (via drill 0.51)
  Top 0.254: v36.58,25.65 37.08,25.15 37.08,17.78 38.1,16.76 U1.3
  Bottom 0.254: U2.7 30.23,25.65 v36.58,25.65 36.68,25.6 38.66,25.6 39.78,24.49 48.56,24.49 49.43,25.35 R1.P$2 51.51,25.4 52.98,23.93 53.09,23.88 53.34,23.62
PB5  (via drill 0.56 pad 1.07, 0.6)
  Top 0.254: v12.83,5.08 17.78,5.08 20.32,5.08 21.08,5.08 v22.86,3.81 | H1.D10 35.26,5.38 35.26,5.49 34.7,6.04 32.26,6.04 32.26,5.44 31.9,5.08 v31.88,5.08
  Bottom 0.254: U2.8 23.62,29.72 13.72,29.72 11.18,27.18 11.18,25.91 11.43,25.4 11.43,21.59 11.18,20.32 11.18,19.05 11.43,17.78 11.43,5.08 v12.83,5.08 | v31.88,5.08 25.65,5.08 24.13,5.08 v22.86,3.81
PB6  (via drill 0.51)
  Top 0.254: v39.12,10.67 39.62,10.16 39.62,3.56 H1.D11 | v32.77,23.62 34.04,22.35 34.04,11.43 v34.8,10.67
  Bottom 0.254: v39.12,10.67 v34.8,10.67 | U2.9 27.18,23.62 v32.77,23.62
RST  (via drill 0.51)
  Top 0.254: v50.8,16.51 52.32,18.03 52.32,41.78 51.82,42.29 51.82,42.67 51.82,45.47 JP1.3 | U2.10 23.88,24.38 23.88,14.99 24.38,14.48 24.38,8.38 23.62,7.62 | 23.62,7.62 23.37,7.37 20.32,7.37 H2.5 | v23.88,7.37 23.62,7.62 | v30.48,6.86 33.02,8.89 v33.02,13.97
  Bottom 0.254: v50.8,16.51 44.45,16.51 U1.1 41.4,13.46 35.05,13.46 v33.02,13.97 | v23.88,7.37 24.89,6.35 29.97,6.35 v30.48,6.86
USB-D_M  (via drill 0.56 pad 1.07)
  Top 0.254: R3.P$1 R2.P$1 58.67,27.69 58.67,26.67 58.67,23.37 D2.P$1 58.17,20.32 58.17,17.53 56.64,16 56.64,13.72 57.91,12.95 57.91,11.68 56.64,10.67 54.61,10.67 X2.D- | X1.USB_M 69.6,32.51 62.48,32.51 v62.23,32.77
  Bottom 0.254: v62.23,32.77 60.33,31.24 58.42,30.48 R2.P$1
USB-D_P  (via drill 0.56 pad 1.07)
  Top 0.254: R1.P$1 55.63,23.88 55.63,19.05 D1.P$1 | v62.23,30.73 69.34,30.73 X1.USB_P
  Bottom 0.254: D1.P$1 52.32,17.78 52.32,14.48 51.05,13.21 51.05,11.94 51.56,11.43 52.32,11.43 53.34,11.43 X2.D+ | v62.23,30.73 61.72,30.23 59.18,29.97 58.67,29.46 58.67,25.4 R1.P$1
VBUS  (via drill 0.51)
  Top 0.508: v62.23,35.31 69.85,35.31 X1.5V | v51.31,15.24 54.86,18.8 54.86,33.27 58.17,36.58 v57.91,36.58
  Bottom 0.508: v62.23,35.31 61.21,35.05 60.45,35.05 J9.1 | v51.31,15.24 50.04,14.22 49.28,13.46 49.02,13.21 49.02,10.92 50.04,9.91 51.31,9.91 53.34,9.91 X2.VBUS
  Bottom 0.61: U3.3 60.33,39.37 60.33,37.85 | 60.33,37.85 J9.1 | v57.91,36.58 57.91,37.85 60.33,37.85
VCC  (via drill 0.51, 0.56 pad 1.07, 1.02)
  Top 0.508: U2.5 33.02,26.42 31.75,25.15 v31.75,19.05 30.48,17.78 v30.48,13.97 | C2.1 C1.1
  Bottom 0.508: J1.C 31.75,45.97 45.97,45.97 46.99,43.43 46.99,35.05 | 46.99,35.05 48.51,33.02 48.77,33.02 | 48.77,33.02 R3.P$2 48.77,33.02 | U2.5 35.31,30.23 39.37,30.23 | 44.45,30.23 45.97,30.23 48.77,33.02 | 44.45,30.23 39.37,30.23 | 46.99,35.05 52.83,35.05 58.04,35.05 58.17,35.05 58.42,35.05 | J7.1 31.24,16 31.75,16.51 v31.75,19.05 | H2.2 23.62,13.21 C2.1 29.72,13.21 v30.48,13.97 30.43,13.56 34.34,9.65 34.54,9.65 34.8,9.4 41.4,9.4 U1.8 | v39.37,29.84 39.37,30.23 | 44.45,30.23 v44.45,31.75 v44.45,34.29 v44.45,36.83 v44.45,39.37 v44.45,41.91 v44.45,44.45 44.45,45.72 | 58.42,35.05 59.18,35.05 J9.2 | v58.04,34.92 58.42,34.92 58.42,35.05
  Bottom 0.61: U3.1 52.83,39.37 52.83,35.05
XYZ  (via drill 0.51)
  Top 0.254: v50.52,42.7 50.6,44.55 50.6,46.89 49.89,47.6 49.89,47.75 49.73,47.75 49.73,47.5 49.53,47.5 49.53,47.7 49.48,47.75 49.43,47.75 49.25,47.63 | 49.43,47.5 49.25,47.63 | 49.43,47.5 49.25,47.63 | 49.43,47.5 49.25,47.63 | 49.43,47.5 49.25,47.63 | 49.43,47.5 49.25,47.63 | 49.43,47.5 49.25,47.63 | 49.43,47.5 49.25,47.63 | 49.43,47.5 49.25,47.63 | 49.43,47.5 49.25,47.63 | 49.43,47.5 49.25,47.63 | 49.43,47.5 49.25,47.63 | 49.43,47.5 49.25,47.63 | 49.43,47.5 49.25,47.63 | 49.43,47.5 49.25,47.63 | 49.43,47.5 49.25,47.63 | 49.43,47.5 49.25,47.63 | 49.43,47.5 49.25,47.63 | 49.43,47.5 49.25,47.63 | 49.43,47.5 49.25,47.63 | 49.43,47.5 49.25,47.63 | 49.43,47.5 49.25,47.63 | 49.43,47.5 49.25,47.63 | 49.43,47.5 49.25,47.63 | 49.43,47.5 49.25,47.63 | 49.43,47.5 49.25,47.63 | 49.43,47.5 49.25,47.63 | 49.43,47.5 49.25,47.63 | 49.43,47.5 49.25,47.63 | 49.43,47.5 49.25,47.63 | 49.43,47.5 49.25,47.63 | 49.43,47.5 49.25,47.63 | 49.43,47.5 49.25,47.63 | 49.43,47.5 49.25,47.63 | 49.43,47.5 49.25,47.63 | 49.43,47.5 49.25,47.63 | 49.43,47.5 49.25,47.63 | 49.43,47.5 49.25,47.63 | 49.43,47.5 49.25,47.63 | 49.43,47.5 49.25,47.63 | 49.43,47.5 49.25,47.63 | 49.43,47.5 49.25,47.63 | 49.43,47.5 49.25,47.63 | 49.43,47.5 49.25,47.63 | 49.43,47.5 49.25,47.63 | 49.43,47.5 49.25,47.63 | 49.43,47.5 49.25,47.63 | 49.43,47.5 49.25,47.63 | 49.43,47.5 49.25,47.63 | 49.43,47.5 49.25,47.63 | 49.43,47.5 49.25,47.63 | 49.43,47.5 49.25,47.63 | 49.43,47.5 49.25,47.63 | 49.43,47.5 49.25,47.63 | 49.43,47.5 49.25,47.63 | 49.43,47.5 49.25,47.63 | 49.43,47.5 49.25,47.63 | 49.43,47.5 49.25,47.63 | 49.43,47.5 49.25,47.63 | 49.43,47.5 49.25,47.63 | 49.43,47.5 49.25,47.63 | 49.43,47.5 49.25,47.63 | 49.43,47.5 49.25,47.63
  Top 0.254: 49.43,47.5 49.25,47.63 | 49.43,47.5 49.25,47.63 | 49.43,47.5 49.25,47.63 | 49.43,47.5 49.25,47.63 | 49.25,47.63 49.38,47.55 49.25,47.63 | 49.43,47.5 49.25,47.63 | 49.43,47.5 49.25,47.63 | 49.43,47.5 49.25,47.63 | 49.43,47.5 49.25,47.63 | 49.43,47.5 49.25,47.63 | 49.43,47.5 49.25,47.63 | 49.43,47.5 49.25,47.63 | 49.43,47.5 49.25,47.63 | 49.43,47.5 49.25,47.63 | 49.43,47.5 49.25,47.63 | 49.43,47.5 49.25,47.63 | 49.43,47.5 49.25,47.63 | 49.43,47.5 49.25,47.63 | 49.43,47.5 49.25,47.63 | 49.43,47.5 49.25,47.63 | 49.43,47.5 49.25,47.63 | 49.43,47.5 49.25,47.63 | 49.43,47.5 49.25,47.63 | 49.43,47.5 49.25,47.63 | 49.43,47.5 49.25,47.63 | 49.43,47.5 49.25,47.63 | 49.43,47.5 49.25,47.63 | 49.43,47.5 49.25,47.63 | 49.43,47.5 49.25,47.63 | 49.43,47.5 49.25,47.63 | 49.43,47.5 49.25,47.63 | 49.43,47.5 49.25,47.63 | 49.43,47.5 49.25,47.63 | 49.43,47.5 49.25,47.63 | 49.43,47.5 49.25,47.63 | 49.43,47.5 49.25,47.63 | 49.43,47.5 49.25,47.63 | 49.43,47.5 49.25,47.63 | 49.43,47.5 49.25,47.63 | 49.43,47.5 49.25,47.63 | 49.43,47.5 49.25,47.63 | 49.43,47.5 49.25,47.63 | 49.43,47.5 49.25,47.63 | 49.43,47.5 49.25,47.63 | 49.43,47.5 49.25,47.63 | 49.43,47.5 49.25,47.63 | 49.43,47.5 49.25,47.63 | 49.43,47.5 49.25,47.63 | 49.43,47.5 49.25,47.63 | 49.43,47.5 49.25,47.63 | 49.43,47.5 49.25,47.63 | 49.43,47.5 49.25,47.63 | 49.43,47.5 49.25,47.63 | 49.43,47.5 49.25,47.63 | 49.43,47.5 49.25,47.63 | 49.43,47.5 49.25,47.63 | 49.43,47.5 49.25,47.63 | 49.43,47.5 49.25,47.63 | 49.43,47.5 49.25,47.63 | 49.43,47.5 49.25,47.63 | 49.43,47.5 49.25,47.63 | 49.43,47.5 49.25,47.63 | 49.43,47.5 49.25,47.63 | 49.43,47.5 49.25,47.63 | 49.43,47.5 49.25,47.63 | 49.43,47.5 49.25,47.63 | 49.43,47.5 49.25,47.63 | 49.43,47.5 49.25,47.63
  Top 0.254: 49.43,47.5 49.25,47.63 | 49.43,47.5 49.25,47.63 | 49.43,47.5 49.25,47.63 | 49.43,47.5 49.25,47.63 | 49.43,47.5 49.25,47.63 | 49.43,47.5 49.25,47.63 | 49.43,47.5 49.25,47.63 | 49.43,47.5 49.25,47.63 | 49.43,47.5 49.25,47.63 | 49.43,47.5 49.25,47.63 | 49.43,47.5 49.25,47.63 | 49.43,47.5 49.25,47.63 | 49.43,47.5 49.25,47.63 | 49.43,47.5 49.25,47.63 | 49.43,47.5 49.25,47.63 | 49.43,47.5 49.25,47.63 | 49.43,47.5 49.25,47.63 | 49.43,47.5 49.25,47.63 | 49.43,47.5 49.25,47.63 | 49.43,47.5 49.25,47.63 | 49.43,47.5 49.25,47.63 | 49.43,47.5 49.25,47.63 | 49.43,47.5 49.25,47.63 | 49.43,47.5 49.25,47.63 | 49.43,47.5 49.25,47.63 | 49.43,47.5 49.25,47.63 | 49.43,47.5 49.25,47.63 | 49.43,47.5 49.25,47.63 | 49.43,47.5 49.25,47.63 | 49.43,47.5 49.25,47.63 | 49.43,47.5 49.25,47.63
  Bottom 0.254: v50.52,42.7 49.78,43.08 49.78,43.05 47.75,43.05 47.75,41.2 47.65,41.2 47.65,40.69 47.8,40.53
(copper drawn outside any net)
  shapes: Bottom area x3, Top area x2

### Text on the board
Top: CSA
Bottom: v14 2012-08-08 | CSA
tPlace: NORM | Vin | +5V | PROG | BOT | GND | +3.3V | USER | 78L33 | VCC | XO Stick | R3 1.5k | RST | D11 | D10 | D+ | GND | VCC | D- | SCL | D5 | SDA | R2 68 | R1 68 | U2 | Break off | & glue to | bottom of | USB tab | POPULATE ONLY *ONE* OF U1/U2 | R4 470 | R5 470 | D2 | D5 | D8 | D7 | D6 | D4 | D1 | D0 | A5 | A4 | X | D1 | ICSP | GND | D+ | D- | RST | o | LED2 | 1 | + | U1 | D13 | C2 0.1uF | POPULATE ONLY | USB | + | *ONE* OF U1/U2 | LED1 | C1 10uF | SDA | D5 | SCL | VCC | Break off | & glue to | bottom of | USB tab
bPlace: RESET | PA1 | PA0 | N/C | N/C | N/C | N/C | Vin | GND | GND | +5V | +3.3V | Vin | +5V | PA2 | PB7 | RST | GND | GND | +3.3V | VCC | U3 | VBUS | CUT VBUS IF U3 INSTALLED | PB7 | PB6 | PB5 | PB4 | GND | VCC | PB3 | PB2 | PB1 | PB0 | Bottom | PA7 | PA6 | PA5 | PA4 | PA3 | PA2 | PA1 | PA0 | AVCC | AGND | GND | PB4 | PB3 | RST | PB0 | PB1 | PB2 | VCC | AREF/PA3 | PA2 | PA3 | PB0 | PB2 | PA4 | PB1 | PA5 | PA6 | PA7 | N/C | PB5 | PB6 | PB2 | PB0 | GND | PB0 | PB2
tValues: Objective Development | Altered by SparkFun Electronics (Ryan Owens) | Altered by C. Scott Ananian for OLPC
tDocu: 1.9" total width on XO | .42" from left side of USB to edge